# Altium schematic sheet Power Supply.SchDoc: Power Supplies
size A4; DocumentNumber: 3; Revision: 0; SheetNumber: 3; SheetTotal: 4
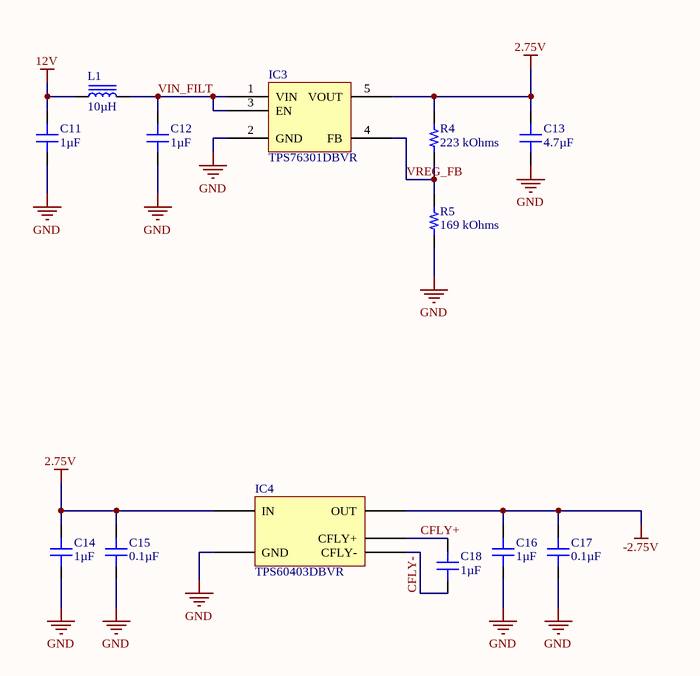
[diagram p0: Power Supply.SchDoc]

## Parts
C11  1µF  [CAP 0603_1608]
C12  1µF  [CAP 0603_1608]
C13  4.7µF  [CAP 0603_1608]
C14  1µF  [CAP 0603_1608]
C15  0.1µF  [CAP 0603_1608]
C16  1µF  [CAP 0603_1608]
C17  0.1µF  [CAP 0603_1608]
C18  1µF  [CAP 0603_1608]
IC3  TPS76301DBVR  [TI SOT-23-5 DBV]
IC4  TPS60403DBVR  [TI SOT-23-5 DBV]
L1  10µH  [IND 0806_2016]
R4  223 kOhms  [RES 0603_1608]
R5  169 kOhms  [RES 0603_1608]

## Nets
2.75V: C13.2 C14.2 C15.2 IC3.5(VOUT) IC4.2(IN) R4.2
12V: C11.2 L1.1
-2.75V: C16.2 C17.2 IC4.1(OUT)
GND: C11.1 C12.1 C13.1 C14.1 C15.1 C16.1 C17.1 IC3.2(GND) IC4.4(GND) R5.1
CFLY+: C18.2 IC4.5(CFLY+)
CFLY-: C18.1 IC4.3(CFLY-)
VIN_FILT: C12.2 IC3.1(VIN) IC3.3(EN) L1.2
VREG_FB: IC3.4(FB) R4.1 R5.2

## Notes on the sheet
- Title
- Size:
- Date:
- A4
- Number:
- Time:
- Revision:
- Sheet
- of
- File:

## Library data of the parts
C11 C12 C14 C16 C18 = CC0603KRX5R8BB105: CAP CER 1UF 25V X5R 0603; Manufacturer: Yageo; Tolerance: ±10%; Part Number: CC0603KRX5R8BB105; Value: 1µF; Applications: General Purpose; Capacitance: 1µF; ComponentLink1Description: Datasheet; ComponentLink1URL: https://www.yageo.com/upload/media/product/productsearch/datasheet/mlcc/UPY-GPHC_X5R_4V-to-50V_25.pdf; ComponentLink2Description: DigiKey Link; ComponentLink2URL: http://digikey.com/product-detail/en/yageo/CC0603KRX5R8BB105/311-1445-1-ND/2833751; Device Package: 0603 (1608 Metric); LastUpdated: 18/01/2020 19:39:01; Lifecycle Status: Active; Minimum Order: 1; Mounting Type: Surface Mount, MLCC; Operating Temperature: -55°C ~ 85°C; Package / Case: 0603 (1608 Metric); Packaging: TapeAndReel; PartId: 5146; Part Status: Active; Price: 0.01; Series: CC; Size / Dimension: 0.063" L x 0.031" W (1.60mm x 0.80mm); Supplier 1: DigiKey; Supplier Part Number 1: 311-1445-1-ND; Temperature Coefficient: X5R; Thickness (Max): 0.035" (0.90mm); Voltage - Rated: 25V
C13 = CL10A475MQ8NNNC: CAP CER 4.7UF 6.3V X5R 0603; Manufacturer: Samsung Electro-Mechanics; Tolerance: ±20%; Part Number: CL10A475MQ8NNNC; Value: 4.7µF; Applications: General Purpose; Capacitance: 4.7µF; ComponentLink1Description: Datasheet; ComponentLink1URL: http://www.samsungsem.com/kr/support/product-search/mlcc/CL10A475MQ8NNNC.jsp; ComponentLink2Description: DigiKey Link; ComponentLink2URL: http://digikey.com/product-detail/en/samsung-electro-mechanics/CL10A475MQ8NNNC/1276-1907-1-ND/3889993; Device Package: 0603 (1608 Metric); LastUpdated: 18/01/2020 19:39:01; Lifecycle Status: Active; Minimum Order: 1; Mounting Type: Surface Mount, MLCC; Operating Temperature: -55°C ~ 85°C; Package / Case: 0603 (1608 Metric); Packaging: TapeAndReel; PartId: 5537; Part Status: Active; Price: 0.01; Series: CL; Size / Dimension: 0.063" L x 0.031" W (1.60mm x 0.80mm); Supplier 1: DigiKey; Supplier Part Number 1: 1276-1907-1-ND; Temperature Coefficient: X5R; Thickness (Max): 0.035" (0.90mm); Voltage - Rated: 6.3V
C15 C17 = CC0603MRY5V8BB104: CAP CER 0.1UF 25V Y5V 0603; Manufacturer: Yageo; Temperature Coefficient: Y5V (F); Tolerance: ±20%; Part Number: CC0603MRY5V8BB104; Value: 0.1µF; Applications: General Purpose; Capacitance: 0.1µF; ComponentLink1Description: Datasheet; ComponentLink1URL: http://www.yageo.com/documents/recent/UPY-GPHC_Y5V_6.3V-to-50V_8.pdf; ComponentLink2Description: DigiKey Link; ComponentLink2URL: http://digikey.com/product-detail/en/yageo/CC0603MRY5V8BB104/311-1363-1-ND/2103147; Device Package: 0603 (1608 Metric); LastUpdated: 18/01/2020 19:39:01; Lifecycle Status: Active; Minimum Order: 1; Mounting Type: Surface Mount, MLCC; Operating Temperature: -30°C ~ 85°C; Package / Case: 0603 (1608 Metric); Packaging: TapeAndReel; PartId: 5132; Part Status: Active; Price: 0.01; Series: CC; Size / Dimension: 0.063" L x 0.031" W (1.60mm x 0.80mm); Supplier 1: DigiKey; Supplier Part Number 1: 311-1363-1-ND; Thickness (Max): 0.035" (0.90mm); Voltage - Rated: 25V
IC3 = TPS76301DBVR: IC REG LIN POS ADJ 150MA SOT23-5; Manufacturer: Texas Instruments; Control Features: Enable; Current - Quiescent (Iq): 100µA; Current - Supply (Max): 140µA; Number of Regulators: 1; Output Configuration: Positive; Output Type: Adjustable; Protection Features: Over Current, Over Temperature, Reverse Polarity; PSRR: 60dB (1kHz); Voltage - Input (Max): 10V; Voltage - Output (Max): 6.5V; Voltage - Output (Min/Fixed): 1.5V; Part Number: TPS76301DBVR; ComponentLink1Description: Datasheet; ComponentLink1URL: http://www.ti.com/general/docs/suppproductinfo.tsp?distId=10&gotoUrl=http%3A%2F%2Fwww.ti.com%2Flit%2Fgpn%2Ftps763; ComponentLink2Description: DigiKey Link; ComponentLink2URL: http://digikey.com/product-detail/en/texas-instruments/TPS76301DBVR/296-11014-1-ND/477331; Current - Output: 150mA; Device Package: SC-74A, SOT-753; LastUpdated: 18/01/2020 20:02:45; Lifecycle Status: Active; Minimum Order: 1; Mounting Type: Surface Mount; Operating Temperature: -40°C ~ 125°C; Package / Case: SC-74A, SOT-753; Packaging: TapeAndReel; Part Status: Active; Price: 0.33; Series: -; Supplier 1: DigiKey; Supplier Part Number 1: 296-11014-1-ND; Supplier Device Package: SOT-23-5
IC4 = TPS60403DBVR: IC REG CHARG PUMP INV 60MA SOT23; Manufacturer: Texas Instruments; Frequency - Switching: 250kHz; Function: Ratiometric; Number of Outputs: 1; Output Configuration: Positive or Negative; Output Type: Fixed; Synchronous Rectifier: No; Topology: Charge Pump; Voltage - Input (Max): 5.25V; Voltage - Input (Min): 1.8V; Voltage - Output (Min/Fixed): -Vin, 2Vin, Vin/2; Part Number: TPS60403DBVR; ComponentLink1Description: Datasheet; ComponentLink1URL: http://www.ti.com/general/docs/suppproductinfo.tsp?distId=10&gotoUrl=http%3A%2F%2Fwww.ti.com%2Flit%2Fgpn%2Ftps60400; ComponentLink2Description: DigiKey Link; ComponentLink2URL: http://digikey.com/product-detail/en/texas-instruments/TPS60403DBVR/296-27005-1-ND/2255295; Current - Output: 60mA; Device Package: SC-74A, SOT-753; LastUpdated: 18/01/2020 19:41:57; Lifecycle Status: Active; Minimum Order: 1; Mounting Type: Surface Mount; Operating Temperature: -40°C ~ 125°C (TJ); Package / Case: SC-74A, SOT-753; Packaging: TapeAndReel; Part Status: Active; Price: 0.41; Series: -; Supplier 1: DigiKey; Supplier Part Number 1: 296-27005-1-ND; Supplier Device Package: SOT-23-5
L1 = LBC2016T100K: FIXED IND 10UH 245MA 820 MOHM; Manufacturer: Taiyo Yuden; Frequency - Self Resonant: 32MHz; Inductance Frequency - Test: 2.52MHz; Material - Core: 0806 (2016 Metric); Shielding: Unshielded; Tolerance: ±10%; Type: Wirewound; Part Number: LBC2016T100K; ComponentLink1Description: Datasheet; ComponentLink1URL: https://ds.yuden.co.jp/TYCOMPAS/ut/detail?pn=LBC2016T100K  &u=M; ComponentLink2Description: DigiKey Link; ComponentLink2URL: http://digikey.com/product-detail/en/taiyo-yuden/LBC2016T100K/587-2536-1-ND/2230402; Current Rating (Amps): 245mA; DC Resistance (DCR): 820mOhm; Device Package: 0806 (2016 Metric); Height - Seated (Max): 0.071" (1.80mm); Inductance: 10µH; LastUpdated: 18/01/2020 19:58:57; Lifecycle Status: Active; Minimum Order: 1; Mounting Type: Surface Mount; Operating Temperature: -40°C ~ 105°C; Package / Case: 0806 (2016 Metric); Packaging: TapeAndReel; PartId: 3165; Part Status: Active; Price: 0.07; Series: LB, C Type; Size / Dimension: 0.079" L x 0.063" W (2.00mm x 1.60mm); Supplier 1: DigiKey; Supplier Part Number 1: 587-2536-1-ND; Supplier Device Package: 0806 (2016 Metric); Value: 10µH
R4 = RN73H1JTTD2233D100: RESISTOR THIN FILM; Manufacturer: KOA Speer Electronics, Inc.; Power (Watts): 0.1W, 1/10W; Temperature Coefficient: ±100ppm/°C; Tolerance: ±0.5%; Part Number: RN73H1JTTD2233D100; Value: 223 kOhms; ComponentLink2Description: DigiKey Link; ComponentLink2URL: http://digikey.com/product-detail/en/koa-speer-electronics-inc/RN73H1JTTD2233D100/2019-RN73H1JTTD2233D100CT-ND/10707088; Composition: Metal Film; Device Package: 0603 (1608 Metric); Features: Automotive AEC-Q200, Moisture Resistant; Height - Seated (Max): 0.022" (0.55mm); LastUpdated: 18/01/2020 19:43:55; Lifecycle Status: Active; Minimum Order: 1; Number of Terminations: 2; Operating Temperature: -55°C ~ 155°C; Package / Case: 0603 (1608 Metric); Packaging: TapeAndReel; PartId: 26816; Part Status: Active; Price: 0.06; Ratings: AEC-Q200; Resistance: 223 kOhms; Series: RN73H; Size / Dimension: 0.063" L x 0.031" W (1.60mm x 0.80mm); Supplier 1: DigiKey; Supplier Part Number 1: 2019-RN73H1JTTD2233D100CT-ND; Supplier Device Package: 0603
R5 = ERJ-3EKF1693V: RES SMD 169K OHM 1% 1/10W 0603; Manufacturer: Panasonic Electronic Components; Power (Watts): 0.1W, 1/10W; Temperature Coefficient: ±100ppm/°C; Part Number: ERJ-3EKF1693V; Value: 169 kOhms; ComponentLink1Description: Datasheet; ComponentLink1URL: https://industrial.panasonic.com/cdbs/www-data/pdf/RDA0000/AOA0000C304.pdf; ComponentLink2Description: DigiKey Link; ComponentLink2URL: http://digikey.com/product-detail/en/panasonic-electronic-components/ERJ-3EKF1693V/P169KHCT-ND/198194; Composition: Thick Film; Device Package: 0603 (1608 Metric); Features: Automotive AEC-Q200; Height - Seated (Max): 0.022" (0.55mm); LastUpdated: 18/01/2020 19:44:29; Lifecycle Status: Active; Minimum Order: 1; Number of Terminations: 2; Operating Temperature: -55°C ~ 155°C; Package / Case: 0603 (1608 Metric); Packaging: TapeAndReel; PartId: 13993; Part Status: Active; Price: 0.01; Ratings: AEC-Q200; Resistance: 169 kOhms; Series: ERJ; Size / Dimension: 0.063" L x 0.031" W (1.60mm x 0.80mm); Supplier 1: DigiKey; Supplier Part Number 1: P169KHCT-ND; Supplier Device Package: 0603; Tolerance: ±1%